# EAGLE design hp6060b v1.8(add buffer) (EAGLE 9.5.1)
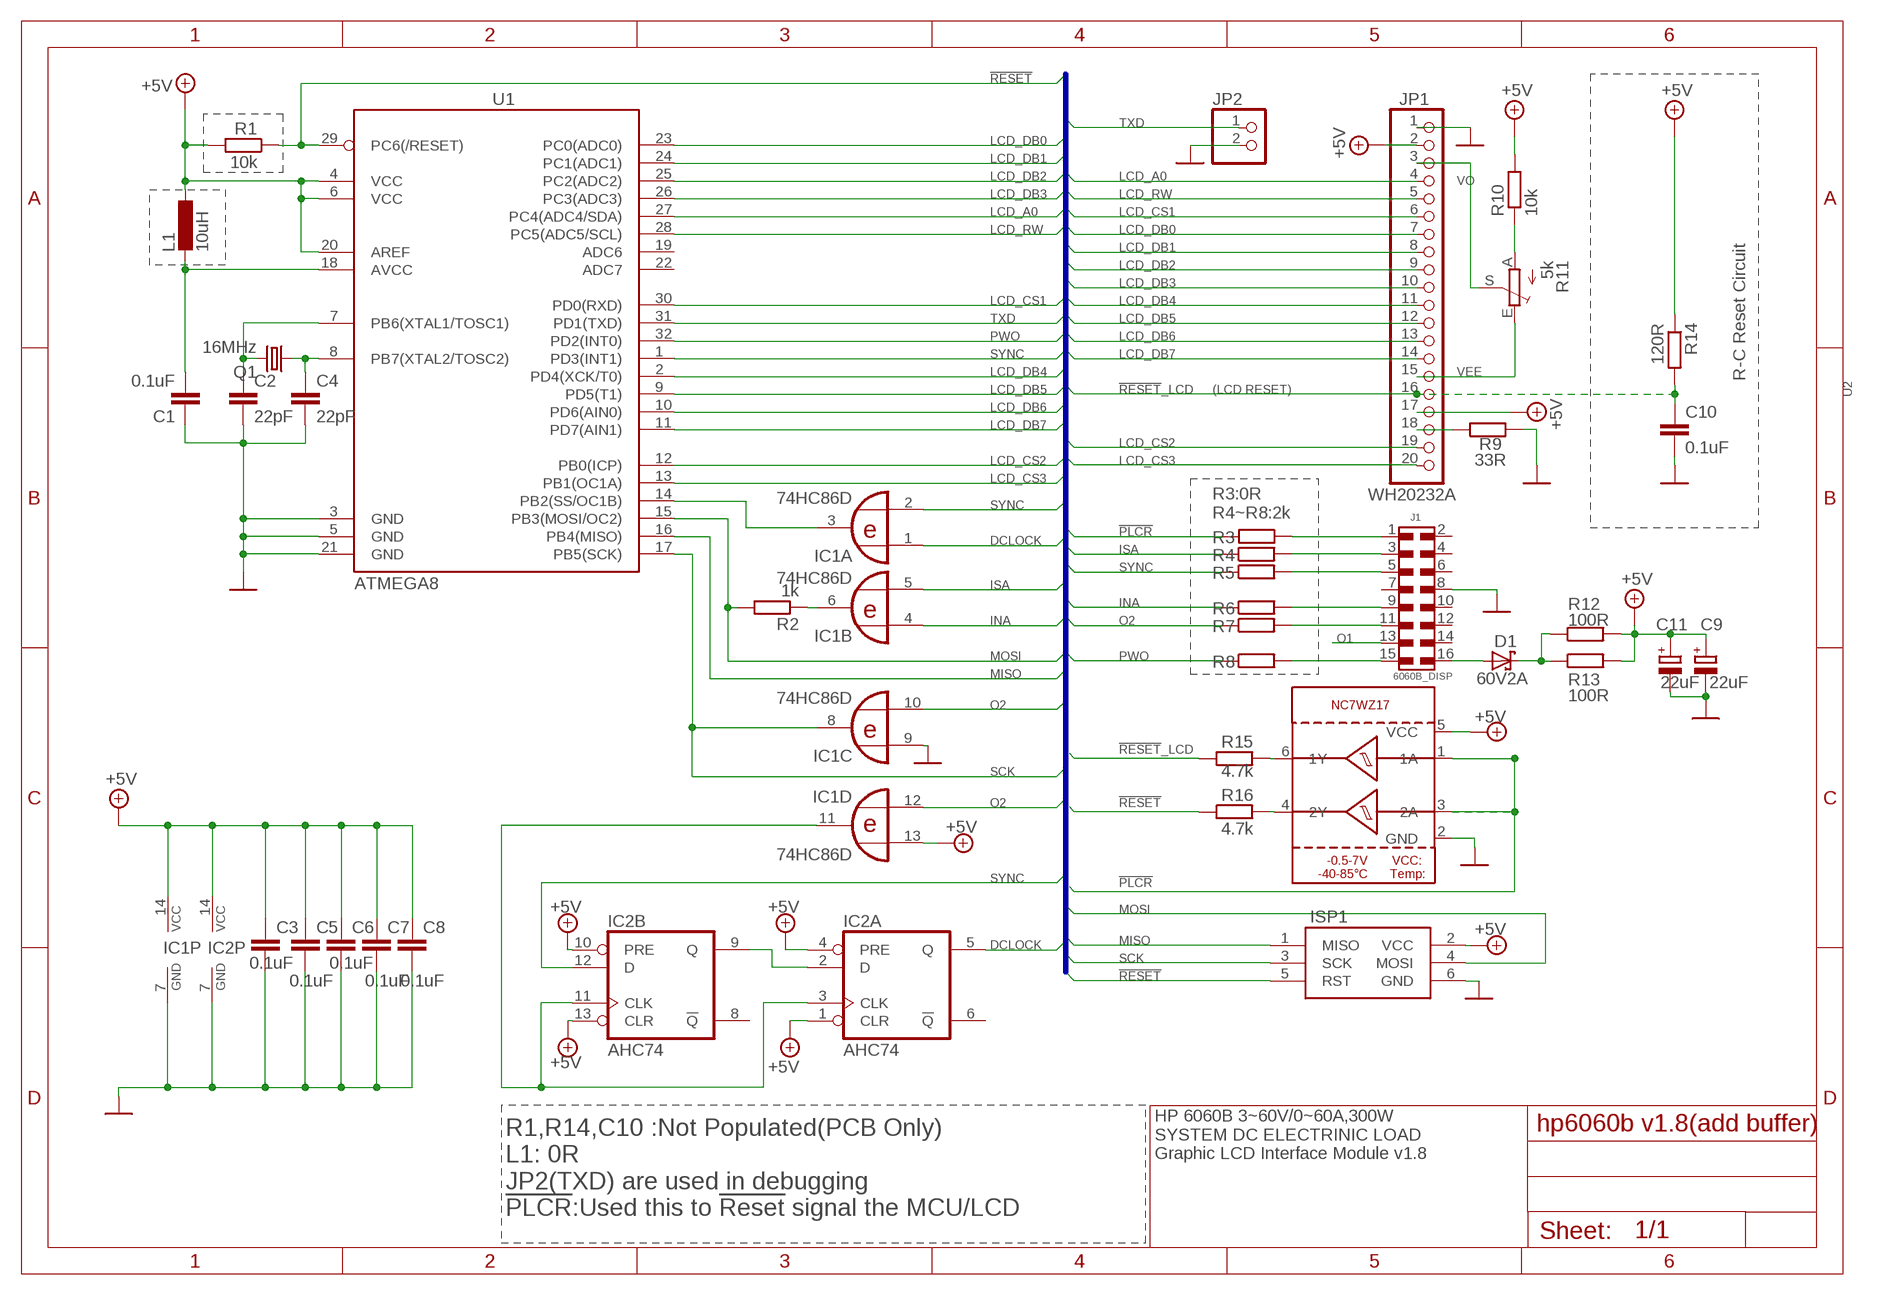
[diagram p0: schematic, sheet 1]

## Parts
C1  0.1uF  C-EUC1206  [C1206]
C2  22pF  C-EUC0603  [C0603]
C3  0.1uF  C-EUC1206  [C1206]
C4  22pF  C-EUC0603  [C0603]
C5  0.1uF  C-EUC1206  [C1206]
C6  0.1uF  C-EUC0805  [C0805]
C7  0.1uF  C-EUC0805  [C0805]
C8  0.1uF  C-EUC0805  [C0805]
C9  22uF  CPOL-EUCT7343  [CT7343]
C10  0.1uF  C-EUC0805  [C0805]
C11  22uF  CPOL-EUCT7343  [CT7343]
D1  60V2A  SCHOTTKY-DIODE  [DIODE_SMB]
IC1  74HC86D  [SO14]
IC2  AHC74  IC_HC74  [TSSOP-14]
ISP1  AVRISP-6  [AVRISP]
J1  6060B_DISP  6100XX21121_61001621121  [61001621121]
JP1  WH20232A  HEADER-1X20ROUND  [1X20_ROUND]
JP2  HEADER-1X2ROUND  [1X02_ROUND]
L1  10uH  L-EUL3225M  [L3225M]
Q1  16MHz  CSM-7X-DU  [CSM-7X-DU]
R1  10k  R-EU_R1206  [R1206]
R2  1k  R-EU_R1206  [R1206]
R3  0R  R-EU_R1206  [R1206]
R4  2k  R-EU_R1206  [R1206]
R5  2k  R-EU_R1206  [R1206]
R6  2k  R-EU_R1206  [R1206]
R7  2k  R-EU_R1206  [R1206]
R8  2k  R-EU_R1206  [R1206]
R9  33R  R-EU_R2010  [R2010]
R10  10k  R-EU_R1206  [R1206]
R11  5k  TRIM_EU-B25P  [B25P]
R12  100R  R-EU_R1206  [R1206]
R13  100R  R-EU_R1206  [R1206]
R14  120R  R-EU_R0805  [R0805]
R15  4.7k  R-EU_R0805  [R0805]
R16  4.7k  R-EU_R0805  [R0805]
U1  ATMEGA8  IC_ATMEGA8  [LQFP32]
U2  IC_BUFFER_NC7WZ17P6X  [SOT65P210X110-6N]

## Nets
!PLCR: R3.2 U2.1(1A) U2.3(2A)
!RESET: ISP1.5(RST) R1.1 R16.1 U1.29(PC6(/RESET))
!RESET!_LCD: C10.1 JP1.16 R14.2 R15.1
!SS: IC1.3(A:O) U1.14(PB2(SS/OC1B))
+5V: C3.1 C5.1 C6.1 C7.1 C8.1 C9.+ C11.+ IC1.13(D:I1) IC1.14(P:VCC) IC2.1(A:CLR) IC2.4(A:PRE) IC2.10(B:PRE) IC2.13(B:CLR) IC2.14(P:VCC) ISP1.2(VCC) JP1.2 JP1.17 L1.1 R1.2 R10.2 R12.2 R13.2 R14.1 U1.4(VCC) U1.6(VCC) U1.20(AREF) U2.5(VCC)
AVCC: C1.2 L1.2 U1.18(AVCC)
DCLOCK: IC1.1(A:I0) IC2.5(A:Q)
GND: C1.1 C2.2 C3.2 C4.2 C5.2 C6.2 C7.2 C8.2 C9.- C10.2 C11.- IC1.7(P:GND) IC1.9(C:I0) IC2.7(P:GND) ISP1.6(GND) J1.8 JP1.1 JP2.2 R9.2 U1.3(GND) U1.5(GND) U1.21(GND) U2.2(GND)
INA: IC1.4(B:I0) R6.1
ISA: IC1.5(B:I1) R4.1
K: JP1.18 R9.1
LCD_A0: JP1.4 U1.27(PC4(ADC4/SDA))
LCD_CS1: JP1.6 U1.30(PD0(RXD))
LCD_CS2: JP1.19 U1.12(PB0(ICP))
LCD_CS3: JP1.20 U1.13(PB1(OC1A))
LCD_DB0: JP1.7 U1.23(PC0(ADC0))
LCD_DB1: JP1.8 U1.24(PC1(ADC1))
LCD_DB2: JP1.9 U1.25(PC2(ADC2))
LCD_DB3: JP1.10 U1.26(PC3(ADC3))
LCD_DB4: JP1.11 U1.2(PD4(XCK/T0))
LCD_DB5: JP1.12 U1.9(PD5(T1))
LCD_DB6: JP1.13 U1.10(PD6(AIN0))
LCD_DB7: JP1.14 U1.11(PD7(AIN1))
LCD_RW: JP1.5 U1.28(PC5(ADC5/SCL))
MISO: ISP1.1(MISO) U1.16(PB4(MISO))
MOSI: ISP1.4(MOSI) R2.2 U1.15(PB3(MOSI/OC2))
N$1: IC1.11(D:O) IC2.3(A:CLK) IC2.11(B:CLK)
N$2: D1.A(C) J1.16
N$3: R10.1 R11.A
N$4: J1.3 R4.2
N$5: J1.5 R5.2
N$6: D1.C(A) R12.1 R13.1
N$8: R15.2 U2.6(1Y)
N$9: J1.9 R6.2
N$10: J1.11 R7.2
N$11: IC2.2(A:D) IC2.9(B:Q)
N$12: J1.15 R8.2
N$13: R16.2 U2.4(2Y)
N$15: IC1.6(B:O) R2.1
N$99: J1.1 R3.1
O1: J1.13
O2: IC1.10(C:I1) IC1.12(D:I0) R7.1
PWO: R8.1 U1.32(PD2(INT0))
SCK: IC1.8(C:O) ISP1.3(SCK) U1.17(PB5(SCK))
SYNC: IC1.2(A:I1) IC2.12(B:D) R5.1 U1.1(PD3(INT1))
TXD: JP2.1 U1.31(PD1(TXD))
VEE: JP1.15 R11.E
VO: JP1.3 R11.S
XTAL1: C2.1 Q1.2 U1.7(PB6(XTAL1/TOSC1))
XTAL2: C4.1 Q1.1 U1.8(PB7(XTAL2/TOSC2))
Unconnected: IC2.6(A:!Q) IC2.8(B:!Q) J1.2 J1.4 J1.6 J1.7 J1.10 J1.12 J1.14 U1.19(ADC6) U1.22(ADC7)

## Buses
DCLOCK,INA,ISA,LCD_A0,LCD_CS1,LCD_CS2,LCD_CS3,LCD_DB0,LCD_DB1,LCD_DB2,LCD_DB3,LCD_DB4,LCD_DB5,LCD_DB6,LCD_DB7,LCD_RW,MISO,MOSI,O2,!PLCR,PWO,!RESET,!RESET!_LCD,SCK,!SS,SYNC,TXD

## Notes on the sheet
- R-C Reset Circuit
- (LCD RESET)
- R3:0R
  R4~R8:2k
- HP 6060B 3~60V/0~60A,300W
  SYSTEM DC ELECTRINIC LOAD
  Graphic LCD Interface Module v1.8
- R1,R14,C10 :Not Populated(PCB Only)
  L1: 0R
  JP2(TXD) are used in debugging
  !PLCR!:Used this to !Reset! signal the MCU/LCD

## Library data of the parts
C1 = rcl:C-EU: CAPACITOR, European symbol
C2-C8 C10 = rcl:C-EU: CAPACITOR, European symbol; SPICEPREFIX: C
C9 C11 = rcl:CPOL-EU: POLARIZED CAPACITOR, European symbol; SPICEPREFIX: C
D1 = eagle-ltspice:SCHOTTKY-DIODE: Schottky Diode; SPICEMODEL: NONE; SPICEPREFIX: D; SPICETYPE: diode
IC1 = 74xx-eu:74*86: Quad 2-input EXCLUSIVE-OR (XOR) gate
IC2 = 0My:IC_HC74: Dual D type positive edge triggered FLIP FLOP, preset and clear
ISP1 = 0adafruit:AVRISP: AVR ISP HEADER Standard 6 pin header for AVR programming
J1 = Wurth_Connectors_WR-PHD:6100XX21121_61001621121: WR-PHD 2.54 mm SMT Dual Pin Header ARTICLE PROPERTIES: Pins:4;​ 6;​ 8;​ 10;​ 12;​ 14;​ 16;​ 20;​ 22;​ 24;​ 26;​ 32;​ 34;​ 36 KIND PROPERTIES: Pitch：2.54 mm Quality Class:3 as per CECC 75 301-802 Rows：Dual Gender：Pin Header Type：Straight MATERIAL PROPERTIES: Insulator Material :PA6T Insulator Flammability Rating:UL94 V-0 Contact Material:Copper Alloy Contact Plating:Gold Contact Type:Stamped GENERAL INFORMATION Operating Temperature:-40 up to +125 °C Compliance:Lead free / RoHS ELECTRICAL PROPERTIES: Rated Current:3 A IR 1:3 A Withstanding Voltage:500 V (AC) Contact Resistance:20 mΩ RISO:1000 MΩ CERTIFICATION UL Approval:E323964 PACKAGING PROPERTIES Packaging:Tube <https://katalog.we-online.com/media/images/v2/o33205v209%20Family_WR-PHD_610xxx21121.jpg> Details see: https://katalog.we-online.com/en/em/PHD_2_54_SMT_DUAL_PIN_HEADER_6100XX21121 Updated by Yingchun,Shan 2019-10-18 2019 (C) Würth Elektronik; DATASHEET-URL: https://katalog.we-online.com/em/datasheet/61001621121.pdf; GENDER: Pin Header; IR: 3A; MATES: WR-PHD 2.54mm Angled DualSocket Header/Dual Socket Header/Dual Socket Header Bottom Entry/Dual Socket Header Bottom Entry Large/SMT Dual Socket Header/SMT Dual Socket Header Bottom Entry; PACKAGING: Tube; PART-NUMBER: 61001621121; PINS: 16; ROWS: Dual; TYPE: Straight
JP1 = 0microbuilder:HEADER-1X20
JP2 = 0microbuilder:HEADER-1X2: PIN HEADER
L1 = rcl:L-EU: INDUCTOR, European symbol
Q1 = crystal:CSM-7X-DU: SMD CRYSTAL Source: www.ecsxtal.com .. Crystal 3.6864MHz CSM_7X_DU.PDF; OC_FARNELL: unknown; OC_NEWARK: unknown
R1-R10 R12-R16 = rcl:R-EU_: RESISTOR, European symbol; SPICEPREFIX: R
R11 = pot:TRIM_EU-: POTENTIOMETER
U1 = 0My:IC_ATMEGA8
U2 = 0My:IC_BUFFER_NC7WZ17P6X: NC7WZ17 TinyLogic® UHS Dual Buffer with Schmitt Trigger Inputs.

## Board
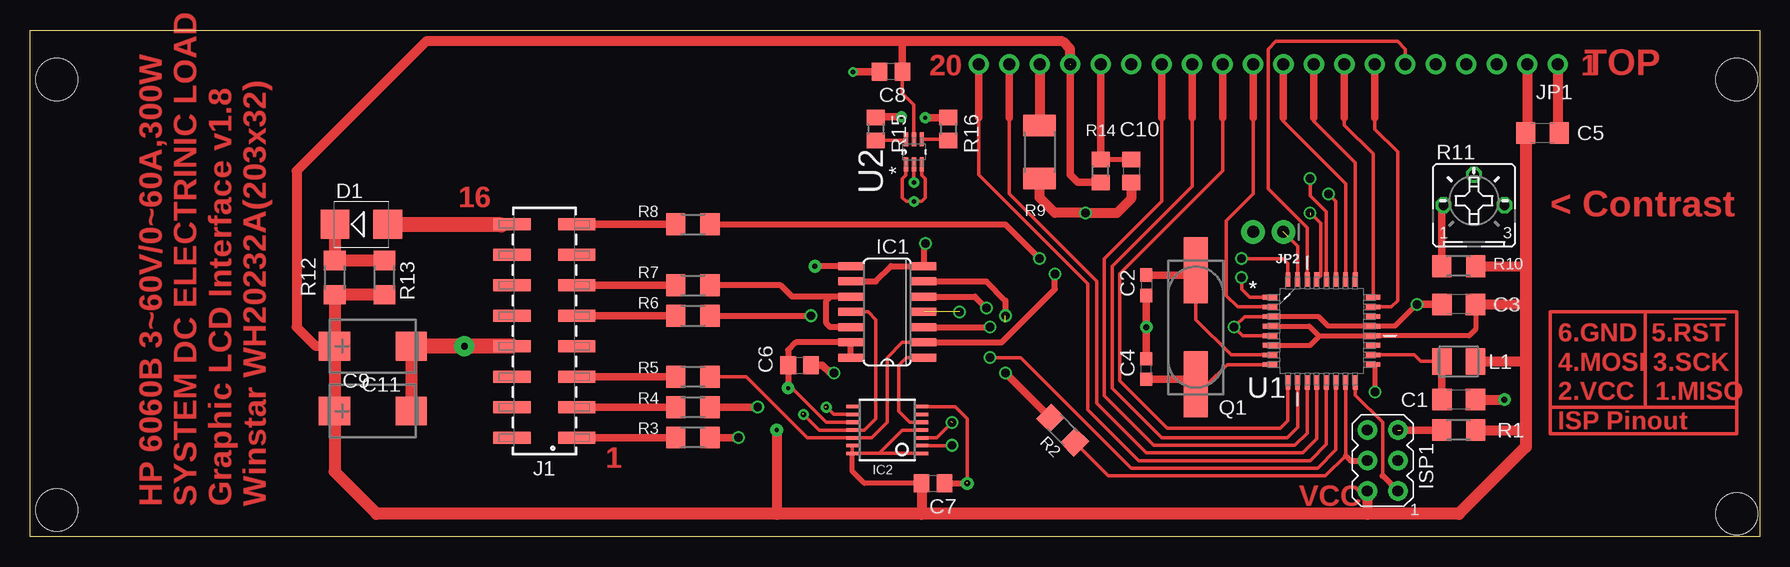
[diagram p1: board, top side]
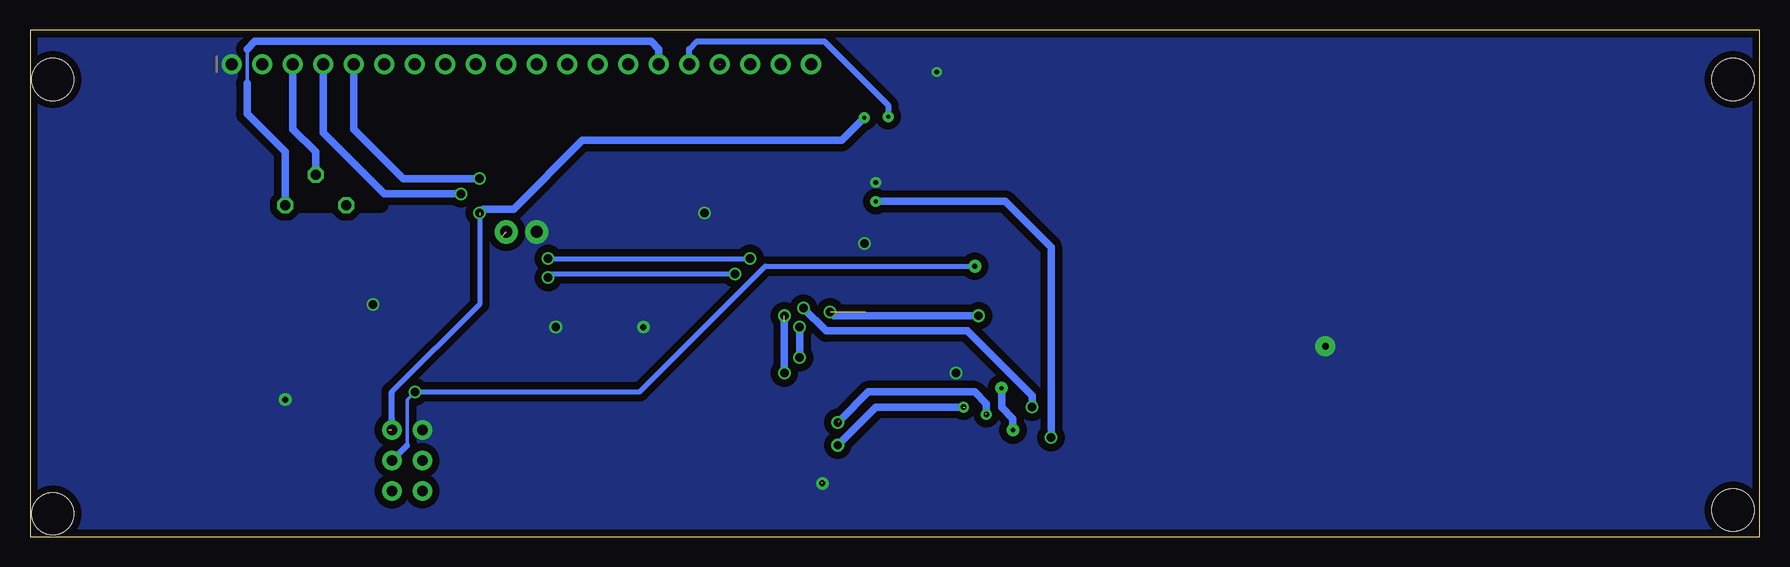
[diagram p2: board, bottom side, seen from below]

Size 144.15 x 42.23 mm. Coordinates in mm from the lower left corner, seen from the top.
Outline: 0,42.23 144.14,42.23 144.14,0 0,0 0,42.23
Copper layers (1*16): Top 0.035mm / dielectric 1.5mm / Bottom 0.035mm
Design rules "SeeedStudio_2layer_DRU_no_angle_20140221 *": minimum track width 6mil, minimum drill 12mil, track to track 6mil, track to pad 6mil, pad to pad 6mil, via to via 6mil, smd to smd 0mil, copper to edge 10mil, drill to drill 10mil, minimum pad ring 10mil, minimum via ring 6mil, stop-mask expansion 2mil, vias tented up to drill 100mil, thermal gap 10mil
Holes 3.5 mm at 2.22,38.1 142.24,38.1 142.24,1.91 2.22,2.22
bRestrict: area 114.9,27.6 to 122.2,28.3

### Footprints (pad centres in the part's own frame; a part is rotated, then mirrored left to right if it is on the bottom)
C1206 = smd 1.6 x 1.8: 1 -1.4,0; 2 1.4,0
C0603 = smd 1.1 x 1: 1 -0.85,0; 2 0.85,0
C0805 = smd 1.3 x 1.5: 1 -0.95,0; 2 0.95,0
CT7343 = smd 2.6 x 2.4: + -3.2,0; - 3.2,0
DIODE_SMB = smd 2.4 x 2.4: A 2.2,0; C -2.2,0
SO14 = smd 0.66 x 2.032: 1 -3.81,-3.073; 2 -2.54,-3.073; 3 -1.27,-3.073; 4 0,-3.073; 5 1.27,-3.073; 6 2.54,-3.073; 7 3.81,-3.073; 8 3.81,3.073; 9 2.54,3.073; 10 1.27,3.073; 11 0,3.073; 12 -1.27,3.073; 13 -2.54,3.073; 14 -3.81,3.073
TSSOP-14 = smd 0.991 x 0.305: 1 -2.918,1.95; 2 -2.918,1.3; 3 -2.918,0.65; 4 -2.918,0; 5 -2.918,-0.65; 6 -2.918,-1.3; 7 -2.918,-1.95; 8 2.918,-1.95; 9 2.918,-1.3; 10 2.918,-0.65; 11 2.918,0; 12 2.918,0.65; 13 2.918,1.3; 14 2.918,1.95
AVRISP = drill 0.9 pad 1.626: 1 -1.27,2.54; 2 1.27,2.54; 3 -1.27,0; 4 1.27,0; 5 -1.27,-2.54; 6 1.27,-2.54
61001621121 = smd 1 x 3.1: 1 -8.89,-2.7; 2 -8.89,2.7; 3 -6.35,-2.7; 4 -6.35,2.7; 5 -3.81,-2.7; 6 -3.81,2.7; 7 -1.27,-2.7; 8 -1.27,2.7; 9 1.27,-2.7; 10 1.27,2.7; 11 3.81,-2.7; 12 3.81,2.7; 13 6.35,-2.7; 14 6.35,2.7; 15 8.89,-2.7; 16 8.89,2.7
1X20_ROUND = drill 1 pad 1.676: 1 -24.13,0; 2 -21.59,0; 3 -19.05,0; 4 -16.51,0; 5 -13.97,0; 6 -11.43,0; 7 -8.89,0; 8 -6.35,0; 9 -3.81,0; 10 -1.27,0; 11 1.27,0; 12 3.81,0; 13 6.35,0; 14 8.89,0; 15 11.43,0; 16 13.97,0; 17 16.51,0; 18 19.05,0; 19 21.59,0; 20 24.13,0
1X02_ROUND = drill 1 pad 1.93: 1 -1.27,0; 2 1.27,0
L3225M = smd 1.6 x 2.2: 1 -1.4,0; 2 1.4,0
CSM-7X-DU = smd 5.5 x 2: 1 -4.75,0; 2 4.75,0
R1206 = smd 1.6 x 1.803: 1 -1.422,0; 2 1.422,0
R2010 = smd 1.8 x 2.7: 1 -2.2,0; 2 2.2,0
B25P = drill 0.813 octagon: A -2.54,0; E 2.54,0; S 0,2.54
R0805 = smd 1.3 x 1.5: 1 -0.95,0; 2 0.95,0
LQFP32 = smd 0.4 x 1.2: 1 -2.8,-4.3; 2 -2,-4.3; 3 -1.2,-4.3; 4 -0.4,-4.3; 5 0.4,-4.3; 6 1.2,-4.3; 7 2,-4.3; 8 2.8,-4.3; 17 2.8,4.3; 18 2,4.3; 19 1.2,4.3; 20 0.4,4.3; 21 -0.4,4.3; 22 -1.2,4.3; 23 -2,4.3; 24 -2.8,4.3 | smd 1.2 x 0.4: 9 4.3,-2.8; 10 4.3,-2; 11 4.3,-1.2; 12 4.3,-0.4; 13 4.3,0.4; 14 4.3,1.2; 15 4.3,2; 16 4.3,2.8; 25 -4.3,2.8; 26 -4.3,2; 27 -4.3,1.2; 28 -4.3,0.4; 29 -4.3,-0.4; 30 -4.3,-1.2; 31 -4.3,-2; 32 -4.3,-2.8
SOT65P210X110-6N = smd 1.168 x 0.356: 1 -1.041,0.66; 2 -1.041,0; 3 -1.041,-0.66; 4 1.041,-0.66; 5 1.041,0; 6 1.041,0.66

### Placement (x,y rotation side)
C1  119.06,11.43 180 top
C2  93.03,20.96 270 top
C3  119.06,19.37 180 top
C4  93.03,13.97 90 top
C5  126.05,33.66 0 top
C6  64.14,14.29 0 top
C7  75.25,4.45 0 top
C8  71.75,38.73 180 top
C9  28.57,10.48 0 top
C10  91.76,30.48 270 top
C11  28.57,15.88 0 top
D1  27.62,26.04 0 top
IC1  71.44,18.73 90 top
IC2  71.44,8.89 180 top
ISP1  112.71,6.35 180 top
J1  42.86,17.15 90 top
JP1  103.19,39.37 0 bottom
JP2  103.19,25.4 180 top
L1  119.06,14.61 180 top
Q1  97.16,17.46 90 top
R1  119.06,8.89 0 top
R2  86.04,8.89 315 top
R3  55.24,8.26 0 top
R4  55.24,10.79 180 top
R5  55.24,13.33 180 top
R6  55.24,18.42 180 top
R7  55.24,20.96 180 top
R8  55.24,26.04 180 top
R9  84.14,32.07 270 top
R10  119.06,22.54 0 top
R11  120.33,27.62 0 top
R12  25.4,21.59 270 top
R13  29.53,21.59 270 top
R14  89.22,30.48 90 top
R15  70.48,33.97 270 top
R16  76.52,33.97 270 top
U1  107.63,17.15 270 top
U2  73.66,32.07 90 top

### Tracks (layer width: path | path; a pad name or v marks a point on that pad's centre or on a via)
!PLCR  (via drill 0.35 pad 0.9, 0.7 pad 1.05)
  Top 0.305: U2.3 74.32,30.14 74.61,29.85 74.61,28.26 74.3,27.94 v73.66,27.94 73.03,27.94 72.71,28.26 72.71,29.85 73,30.14 U2.1
  Top 0.61: R3.2 v59.06,8.26
  Bottom 0.61: v59.06,8.26 59.06,24.13 62.87,27.94 v73.66,27.94
!RESET  (via drill 0.35 pad 0.9, 0.7 pad 1.05)  (2 unrouted)
  Top 0.254: R1.1 117.16,8.89
  Top 0.305: U1.29 107.55,21.76 107.55,26.12 v106.68,26.99
  Top 0.406: 114.88,8.89
  Top 0.508: R16.1
  Top 0.61: 117.16,8.89 114.88,8.89 114.25,8.89 | v74.61,34.92 R16.1
  Bottom 0.406: 106.68,26.78 106.68,19.37 113.98,12.06 | 113.98,9.79
  Bottom 0.508: ISP1.5 113.98,9.79 113.98,12.06
  Bottom 0.61: v106.68,26.99 106.36,27.31 103.82,27.31 98.11,33.02 76.52,33.02 v74.61,34.92
!RESET!_LCD  (via drill 0.35 pad 0.9)
  Top 0.406: C10.1 R14.2
  Top 0.508: 70.57,35 R15.1
  Top 0.61: JP1.16 R14.2 | v72.63,35 70.57,35
  Bottom 0.508: JP1.16 89.22,40.64 88.58,41.27 77.94,41.27 72.63,35.96 v72.63,35
!SS  (via drill 0.7 pad 1.05)
  Top 0.305: U1.14 108.83,7.23 107.31,5.71 91.76,5.71 82.55,14.92 v80.01,14.92
  Top 0.508: IC1.3 v80.01,17.46
  Bottom 0.61: v80.01,17.46 v80.01,14.92
+5V  (via drill 0.35 pad 1.05)  (1 unrouted)
  Top 0.254: IC2.14 IC2.1
  Top 0.305: U1.20 111.68,16.75 | 74.36,4.19 74.3,4.13 C7.1 | 70.49,6.94 IC2.1 | IC2.4 72.71,8.89 70.76,6.94 IC2.14 IC2.13 | 68.42,14.87 IC1.14 | IC2.10 66.34,9.54 63.5,12.38 v63.18,12.38 | U2.5 73.66,35.99 72.7,36.95 C8.1
  Top 0.406: C3.1 120.46,17.28 119.93,16.75 111.68,16.75 | 107.4,16.75 U1.20 | U1.4 106.6,17.55 107.4,16.75 | U1.6 106.67,15.95 107.4,16.68 107.4,16.75 | 86.68,31.75 86.68,30.16 | C7.1 69.53,4.45 68.52,5.46 IC2.14
  Top 0.508: IC1.14 IC1.13 63.82,16.19 63.18,15.56 C6.1 v63.18,12.38 | ISP1.2 111.44,2.91 | 111.44,2.91 | 111.44,2.91 111.88,3.46 | 111.44,2.91 | 111.44,2.91 111,3.46 | 111.44,2.91 111.88,3.46 | ISP1.2 111.88,3.46 | 111.44,2.91 111,3.46 | ISP1.2 111,3.46 | 111.44,2.91 111.88,3.46 | ISP1.2 111.88,3.46 | 111.44,2.91 111,3.46 | ISP1.2 111,3.46
  Top 0.61: C5.1 124.78,33.78 | 86.68,39.32 86.68,30.16 87.31,29.53 R14.1 | C8.1 72.7,41.27 72.71,41.27 | 124.78,38.37
  Top 0.813: JP1.2 124.78,38.37 124.78,33.78 | 111.44,2.91 111.44,1.91 | R1.2 124.65,8.89 | L1.1 124.65,14.61 | R10.2 124.65,22.54 | C3.1 124.65,19.37 | C7.1 74.3,1.91 | C11.+ 25.08,15.88 23.81,15.88 22.22,17.46 22.22,30.48 33.02,41.27 72.71,41.27 86.04,41.27 86.68,40.64 JP1.17 | v62.23,8.89 62.23,1.91
  Top 1.016: C5.1 124.65,22.54 124.65,19.37 124.65,14.61 124.65,8.89 124.65,7.49 119.06,1.91 111.44,1.91 74.3,1.91 62.23,1.91 28.89,1.91 25.38,5.42 C9.+ | 25.38,8.89 C9.+ | C11.+ C9.+ | R13.2 R12.2 25.4,16.19 25.08,15.88
  Top 1.27: R12.2 25.43,20.13
  Bottom 0.61: v63.18,12.38 63.18,10.79 62.23,9.84 v62.23,8.89
AVCC
  Top 0.305: U1.18 115.35,15.14 115.89,14.61 L1.2
  Top 0.61: L1.2 C1.2
DCLOCK
  Top 0.305: IC1.1 73.03,14.92 72.39,14.29 72.39,10.48 73.33,9.54 IC2.5
GND  (via drill 0.4 pad 0.8, 0.4 pad 0.9, 0.5 pad 1.05, 0.55 pad 1.66, 0.7 pad 1.05)  (1 unrouted)
  Top 0.305: U1.3 101.21,18.35 100.44,17.57 | U1.5 101.05,16.75 v100.33,17.46 | 78.11,4.56 78.1,4.56 | IC2.7 77.11,10.84 78.11,9.84 v78.11,4.45 | U2.2 v73.66,29.53
  Top 0.406: U1.3 107.39,18.35 108.19,17.55 U1.21 113.75,17.55 v115.57,19.37 | v93.03,17.46 93.03,17.58 93.03,18.21
  Top 0.508: 127.32,33.78 C5.2 | IC1.7 74.61,22.54 | C7.2 v78.11,4.45 | IC1.7 74.51,24.35 v74.61,24.45 | IC1.9 70.49,21.27 71.75,22.54 IC1.7
  Top 0.61: C2.2 93.03,17.58 | C4.2 v93.03,17.46 | C3.2 v115.57,19.37 | v66.99,13.65 66.67,13.65 66.04,14.29 C6.2 | C8.2 v68.58,38.73 | 127.32,38.37
  Top 0.813: JP1.1 127.32,38.37 127.32,33.78 | C1.1 v122.87,11.43 | C10.2 91.76,28.15 90.59,26.99 v87.95,26.99 85.41,26.99 84.14,28.26 R9.2
  Top 1.016: C11.- C9.-
  Top 1.27: J1.8 v36.2,15.88 C11.-
  pour Bottom (isolate 0.61, rank 6, no thermals): -0.64,42.61 144.62,42.61 144.62,-0.27 -0.64,-0.27
INA  (via drill 0.7 pad 1.05)  (1 unrouted)
  Top 0.508: R6.1 v65.09,18.42
  Bottom 0.61: v65.09,18.42 77.15,18.42 v77.47,18.73
ISA  (via drill 0.7 pad 1.05)
  Top 0.508: IC1.5 78.74,20 v79.69,19.05
  Top 0.61: R4.1 v60.64,10.79
  Bottom 0.61: v79.69,19.05 77.79,17.15 66.04,17.15 60.64,11.75 v60.64,10.79
K
  Top 0.813: JP1.18 R9.1
LCD_A0  (via drill 0.7 pad 1.05)
  Top 0.305: v108.22,28.58 108.83,27.96 U1.27
  Bottom 0.61: JP1.4 119.7,38.37 | 119.7,38.37 119.7,33.66 114.62,28.58 v108.22,28.58 108.27,28.36 | 119.7,38.37
LCD_CS1
  Top 0.305: 106.36,21.52 U1.30 106.43,25.74 103.19,28.99 103.19,40.64 103.82,41.27 113.98,41.27 114.62,40.64 JP1.6
LCD_CS2
  Top 0.305: U1.12 107.23,8.17 106.05,6.98 93.04,6.98 88.9,11.13 88.9,21.27 81.6,28.58 81.6,34.92
  Top 0.61: JP1.19 81.6,38.37 | 81.6,34.92 81.6,38.37 | 81.6,38.37
LCD_CS3
  Top 0.305: U1.13 108.03,7.7 106.68,6.35 92.39,6.35 88.14,10.6 88.14,21.08 79.06,30.16 79.06,34.92
  Top 0.61: 79.06,34.92 JP1.20
LCD_DB0
  Top 0.305: 112.08,19.15 U1.23 113.44,19.15 113.98,19.69 113.98,32.07 112.08,33.97 112.08,34.92
  Top 0.61: JP1.7 112.08,38.37 | 112.08,38.37 112.08,34.92 | 112.08,38.37
LCD_DB1
  Top 0.305: U1.24 111.93,31.9 109.54,34.29 109.54,34.92
  Top 0.61: JP1.8 109.54,38.37 | 109.54,38.37 109.54,34.92 | 109.54,38.37
LCD_DB2
  Top 0.305: 107,34.92 107,34.61 110.43,31.17 U1.25
  Top 0.61: JP1.9 107,38.37 | 107,38.37 107,34.92 | 107,38.37
LCD_DB3
  Top 0.305: U1.26 109.63,29.43 104.46,34.61 104.46,34.92
  Top 0.61: JP1.10 104.46,38.37 | 104.46,38.37 104.46,34.92 | 104.46,38.37
LCD_DB4
  Top 0.305: 103.3,19.17 U1.2 100.65,19.15 99.69,20.1 99.69,26.35 101.92,28.58 101.92,34.92
  Top 0.61: JP1.11 101.92,38.37 | 101.92,38.37 101.92,34.92 | 101.92,38.37
LCD_DB5
  Top 0.305: U1.9 104.83,9.67 104.2,9.04 94.79,9.04 90.8,13.02 90.8,21.91 99.38,30.48 99.38,34.92
  Top 0.61: JP1.12 99.38,38.37 | 99.38,38.37 99.38,34.92 | 99.38,38.37
LCD_DB6
  Top 0.305: U1.10 105.63,9.11 104.78,8.26 94.3,8.26 90.17,12.38 90.17,22.54 96.84,29.21 96.84,34.92
  Top 0.61: JP1.13 96.84,38.37 | 96.84,38.37 96.84,34.92 | 96.84,38.37
LCD_DB7
  Top 0.305: U1.11 106.43,8.64 105.41,7.62 93.66,7.62 89.53,11.75 89.53,23.18 94.3,27.94 94.3,34.92
  Top 0.61: JP1.14 94.3,38.37 | 94.3,38.37 94.3,34.92 | 94.3,38.37
LCD_RW  (via drill 0.7 pad 1.05)
  Top 0.305: v106.68,29.85 106.68,28.42 108.03,27.07 U1.28
  Bottom 0.61: JP1.5 117.16,38.37 | v106.68,29.85 113.03,29.85 117.16,33.97 117.16,38.37 | 117.16,38.37
MISO
  Top 0.305: U1.16 110.43,11.8 112.71,9.53 112.71,5.08
  Top 0.508: ISP1.1 112.71,5.08
MOSI
  Top 0.305: U1.15 109.63,6.76 107.95,5.08 89.85,5.08 R2.2
  Top 0.406: 109.63,6.76 110.05,6.35
  Top 0.508: 110.05,6.35 ISP1.4
N$1  (via drill 0.45 pad 0.9, 0.7 pad 1.05)  (2 unrouted)
  Top 0.305: IC1.11 69.85,18.73 70.49,18.1 70.49,9.84 69.53,8.89 IC2.11 65.76,8.89 v64.45,10.19 | IC2.3 75.55,8.24 v76.83,9.53
  Bottom 0.61: 64.45,10.29 64.45,11.09 65.43,12.06 74.3,12.06 76.73,9.63
N$2
  Top 1.016: J1.16 39.33,26.04 39.28,25.99 | 29.87,25.99 D1.A
  Top 1.27: 39.28,25.99 29.87,25.99
N$3
  Top 0.61: R11.A 117.64,27.47 R10.1
N$4
  Top 0.61: J1.3 R4.2
N$5
  Top 0.61: J1.5 R5.2
N$6
  Top 1.016: D1.C 25.4,26.01 R12.1 R13.1
N$7
  Top 0.305: 134.62,18.73 126.68,18.73 126.68,10.79 | 134.62,18.73 142.24,18.73 142.24,10.79 | 142.24,10.79 142.24,8.57 126.68,8.57 126.68,10.79 | 126.68,10.79 134.62,10.79 | 134.62,10.79 142.24,10.79 | 134.62,18.73 134.62,10.79
N$8
  Top 0.305: U2.6 72.91,33.02 R15.2
N$9
  Top 0.61: J1.9 R6.2
N$10
  Top 0.61: J1.11 R7.2
N$11  (via drill 0.45 pad 0.9, 0.7 pad 1.05)  (1 unrouted)
  Top 0.305: IC2.9 66.96,10.19 v66.36,10.79 | IC2.2 76.8,7.59 v76.83,7.62
  Bottom 0.61: 66.25,10.79 73.66,10.79 v76.83,7.62
N$12
  Top 0.61: J1.15 R8.2
N$13
  Top 0.305: U2.4 76.43,33.11 R16.2
N$15  (via drill 0.7 pad 1.05)  (2 unrouted)
  Top 0.508: IC1.6 79.69,21.27 81.28,19.69 v81.28,18.42
  Top 0.61: v81.28,13.65 R2.1
  Bottom 0.61: 81.28,17.89 v81.28,13.65
N$99
  Top 0.61: J1.1 R3.1
O2
  Top 0.406: 56.98,21.27 R7.1
  Top 0.508: R7.1 62.55,20.96 63.5,20 66.67,20 | IC1.10 66.67,20 | IC1.12 66.67,17.46 66.36,17.78 66.36,19.69 66.67,20
PWO  (via drill 0.7 pad 1.05)
  Top 0.305: U1.32 104.83,22.77 104.43,23.18 v100.97,23.18
  Top 0.508: R8.1 81.28,26.04 v84.14,23.18
  Bottom 0.406: v100.97,23.18 v84.14,23.18
SCK  (via drill 0.4 pad 1.05, 0.7 pad 1.05)
  Top 0.406: U1.17 112.08,14.2 v112.08,12.06
  Top 0.508: IC1.8 v65.41,22.54
  Bottom 0.305: v112.08,12.06 112.71,11.43 112.71,7.62
  Bottom 0.406: v112.08,12.06 93.34,12.06 82.87,22.54 v65.41,22.54
  Bottom 0.508: 112.71,7.62 ISP1.3
SYNC  (via drill 0.7 pad 1.05)
  Top 0.305: U1.1 101.66,19.95 100.97,20.64 v100.97,21.59 | 75.25,16.19 72.71,16.19 71.44,14.92 71.44,9.53 70.15,8.24 IC2.12 64.78,8.24 59.69,13.33 R5.1
  Top 0.406: 75.25,16.19 73.98,16.19
  Top 0.508: 75.25,16.19 IC1.2 80.96,16.19 85.41,20.64 v85.41,21.91
  Bottom 0.406: v100.97,21.59 100.65,21.91 v85.41,21.91
TXD  (1 unrouted)
  Top 0.305: U1.31 105.63,24.23 104.85,25.01
VEE
  Bottom 0.305: 126.05,40.64 126.05,37.78
  Bottom 0.406: 91.76,40.37
  Bottom 0.61: 126.05,37.78 126.05,35.24 122.87,32.07 R11.E | JP1.15 91.76,40.37 91.76,40.64 92.39,41.27 125.41,41.27 126.05,40.64
VO
  Bottom 0.61: JP1.3 122.24,38.37 | 122.24,38.37 | R11.S 120.33,32.07 122.24,33.97 122.24,38.37
XTAL1
  Top 0.305: U1.7 100.11,15.14 97.16,18.1 Q1.2 97.16,21.81
  Top 0.61: 97.16,21.81 C2.1
XTAL2
  Top 0.305: U1.8 99.75,14.35 98.11,12.7 97.16,12.7 | 97.16,12.7 96.84,12.7 96.84,13.12 | 97.16,12.7 Q1.1
  Top 0.61: C4.1 96.84,13.12

### Text on the board
Top: TOP | 20 | 1 | 16 | < Contrast | 6.GND 5.!RST / 4.MOSI 3.SCK / 2.VCC 1.MISO / ISP Pinout | 1 | HP 6060B 3~60V/0~60A,300W / SYSTEM DC ELECTRINIC LOAD / Graphic LCD Interface v1.8 / Winstar WH20232A(203x32) | VCC